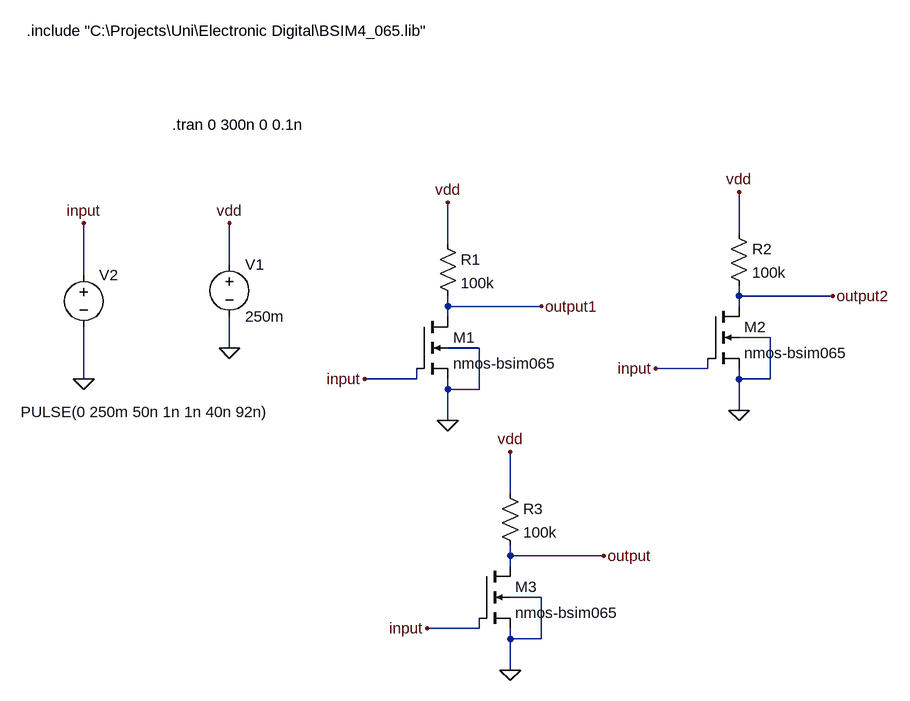
[diagram p0: schematic CMOS vs Resistor-Load NMOS.asc]
CMOS vs Resistor-Load NMOS.asc, the LTspice schematic file:
Version 4.1
SHEET 1 1216 796
WIRE 848 48 848 -16
WIRE 400 64 400 0
WIRE 64 96 64 32
WIRE -160 112 -160 32
WIRE 848 144 848 128
WIRE 992 144 848 144
WIRE 400 160 400 144
WIRE 544 160 400 160
WIRE 848 160 848 144
WIRE 400 176 400 160
WIRE 896 208 848 208
WIRE 64 224 64 176
WIRE 448 224 400 224
WIRE 800 256 800 240
WIRE 800 256 720 256
WIRE -160 272 -160 192
WIRE 352 272 352 256
WIRE 352 272 272 272
WIRE 848 272 848 256
WIRE 896 272 896 208
WIRE 896 272 848 272
WIRE 400 288 400 272
WIRE 448 288 448 224
WIRE 448 288 400 288
WIRE 848 320 848 272
WIRE 400 336 400 288
WIRE 496 448 496 384
WIRE 496 544 496 528
WIRE 640 544 496 544
WIRE 496 560 496 544
WIRE 544 608 496 608
WIRE 448 656 448 640
WIRE 448 656 368 656
WIRE 496 672 496 656
WIRE 544 672 544 608
WIRE 544 672 496 672
WIRE 496 720 496 672
FLAG 400 336 0
FLAG 64 224 0
FLAG 64 32 vdd
FLAG 400 0 vdd
FLAG 272 272 input
FLAG 544 160 output1
FLAG -160 272 0
FLAG -160 32 input
FLAG 848 320 0
FLAG 848 -16 vdd
FLAG 720 256 input
FLAG 992 144 output2
FLAG 496 720 0
FLAG 496 384 vdd
FLAG 368 656 input
FLAG 640 544 output
SYMBOL res 384 48 R0
SYMATTR InstName R1
SYMATTR Value 100k
SYMBOL voltage 64 80 R0
WINDOW 123 0 0 Left 0
WINDOW 39 0 0 Left 0
SYMATTR InstName V1
SYMATTR Value 250m
SYMBOL voltage -160 96 R0
WINDOW 3 -97 227 Left 2
WINDOW 123 0 0 Left 0
WINDOW 39 0 0 Left 0
SYMATTR InstName V2
SYMATTR Value PULSE(0 250m 50n 1n 1n 40n 92n)
SYMBOL nmos4 352 176 R0
SYMATTR InstName M1
SYMATTR Value nmos-bsim065
SYMATTR Value2 l=65n w=140n
SYMBOL res 832 32 R0
SYMATTR InstName R2
SYMATTR Value 100k
SYMBOL nmos4 800 160 R0
SYMATTR InstName M2
SYMATTR Value nmos-bsim065
SYMATTR Value2 l=130n w=280n
SYMBOL res 480 432 R0
SYMATTR InstName R3
SYMATTR Value 100k
SYMBOL nmos4 448 560 R0
SYMATTR InstName M3
SYMATTR Value nmos-bsim065
SYMATTR Value2 l=100n w=200n
TEXT -24 -120 Left 2 !.tran 0 300n 0 0.1n
TEXT -248 -264 Left 2 !.include "C:\\Projects\\Uni\\Electronic Digital\\BSIM4_065.lib"

The netlist it stands for:
* CMOS vs Resistor-Load NMOS.asc
R1 vdd output1 100k
V1 vdd 0 250m
V2 input 0 PULSE(0 250m 50n 1n 1n 40n 92n)
M1 output1 input 0 0 nmos-bsim065 l=65n w=140n
R2 vdd output2 100k
M2 output2 input 0 0 nmos-bsim065 l=130n w=280n
R3 vdd output 100k
M3 output input 0 0 nmos-bsim065 l=100n w=200n
.model NMOS NMOS
.model PMOS PMOS
.lib standard.mos
.tran 0 300n 0 0.1n
.include "C:\Projects\Uni\Electronic Digital\BSIM4_065.lib"
.backanno
.end

* Results of the author's LTspice run, read from the files saved beside the schematic
* Operating Point, zero values left out:
*   V(output) = 244.9 mV
*   V(output1) = 236.5 mV
*   V(output2) = 245.4 mV
*   V(vdd) = 250 mV
*   I(R1) = 135.4 nA
*   I(R2) = 46.43 nA
*   I(R3) = 51.18 nA
*   I(V1) = -233 nA
*   I(V2) = 4.384 pA
*   Id(M1) = 135.4 nA
*   Id(M2) = 46.43 nA
*   Id(M3) = 51.18 nA
*   Ig(M2) = -2.056 pA
*   Ig(M3) = -1.439 pA
*   Is(M1) = -135.4 nA
*   Is(M2) = -46.43 nA
*   Is(M3) = -51.18 nA
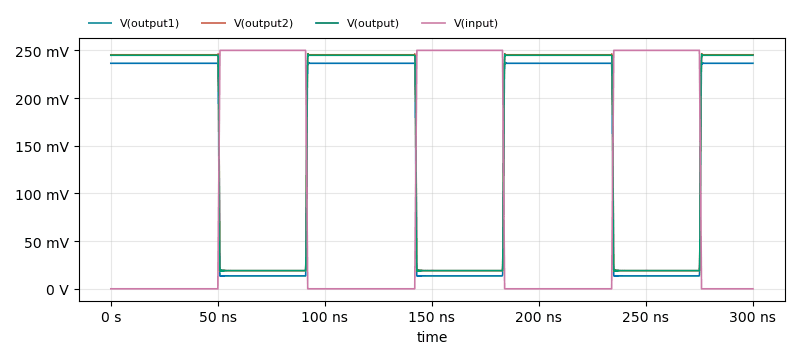
[diagram p1: Transient Analysis of CMOS vs Resistor-Load NMOS.asc, plotted from the saved traces]
* Transient Analysis, 1 run:
*   V(output1): min 13.4 mV, max 237.6 mV, average 144.9 mV, rms 181.4 mV, last 236.5 mV
*   V(output2): min 18.38 mV, max 246.5 mV, average 152.9 mV, rms 188.8 mV, last 245.4 mV
*   V(output): min 18.7 mV, max 246 mV, average 152.6 mV, rms 188.4 mV, last 244.9 mV
*   V(input): min 0 V, max 250 mV, average 102.5 mV, rms 159.4 mV, last 0 V